# EasyEDA schematic SCH_Arduino-Nano_2025-06-12.json
TITLE: Arduino Nano; REV: 1.0; Date: 2025-06-07; Sheet: 1/1; Company: Jakub Witkowski
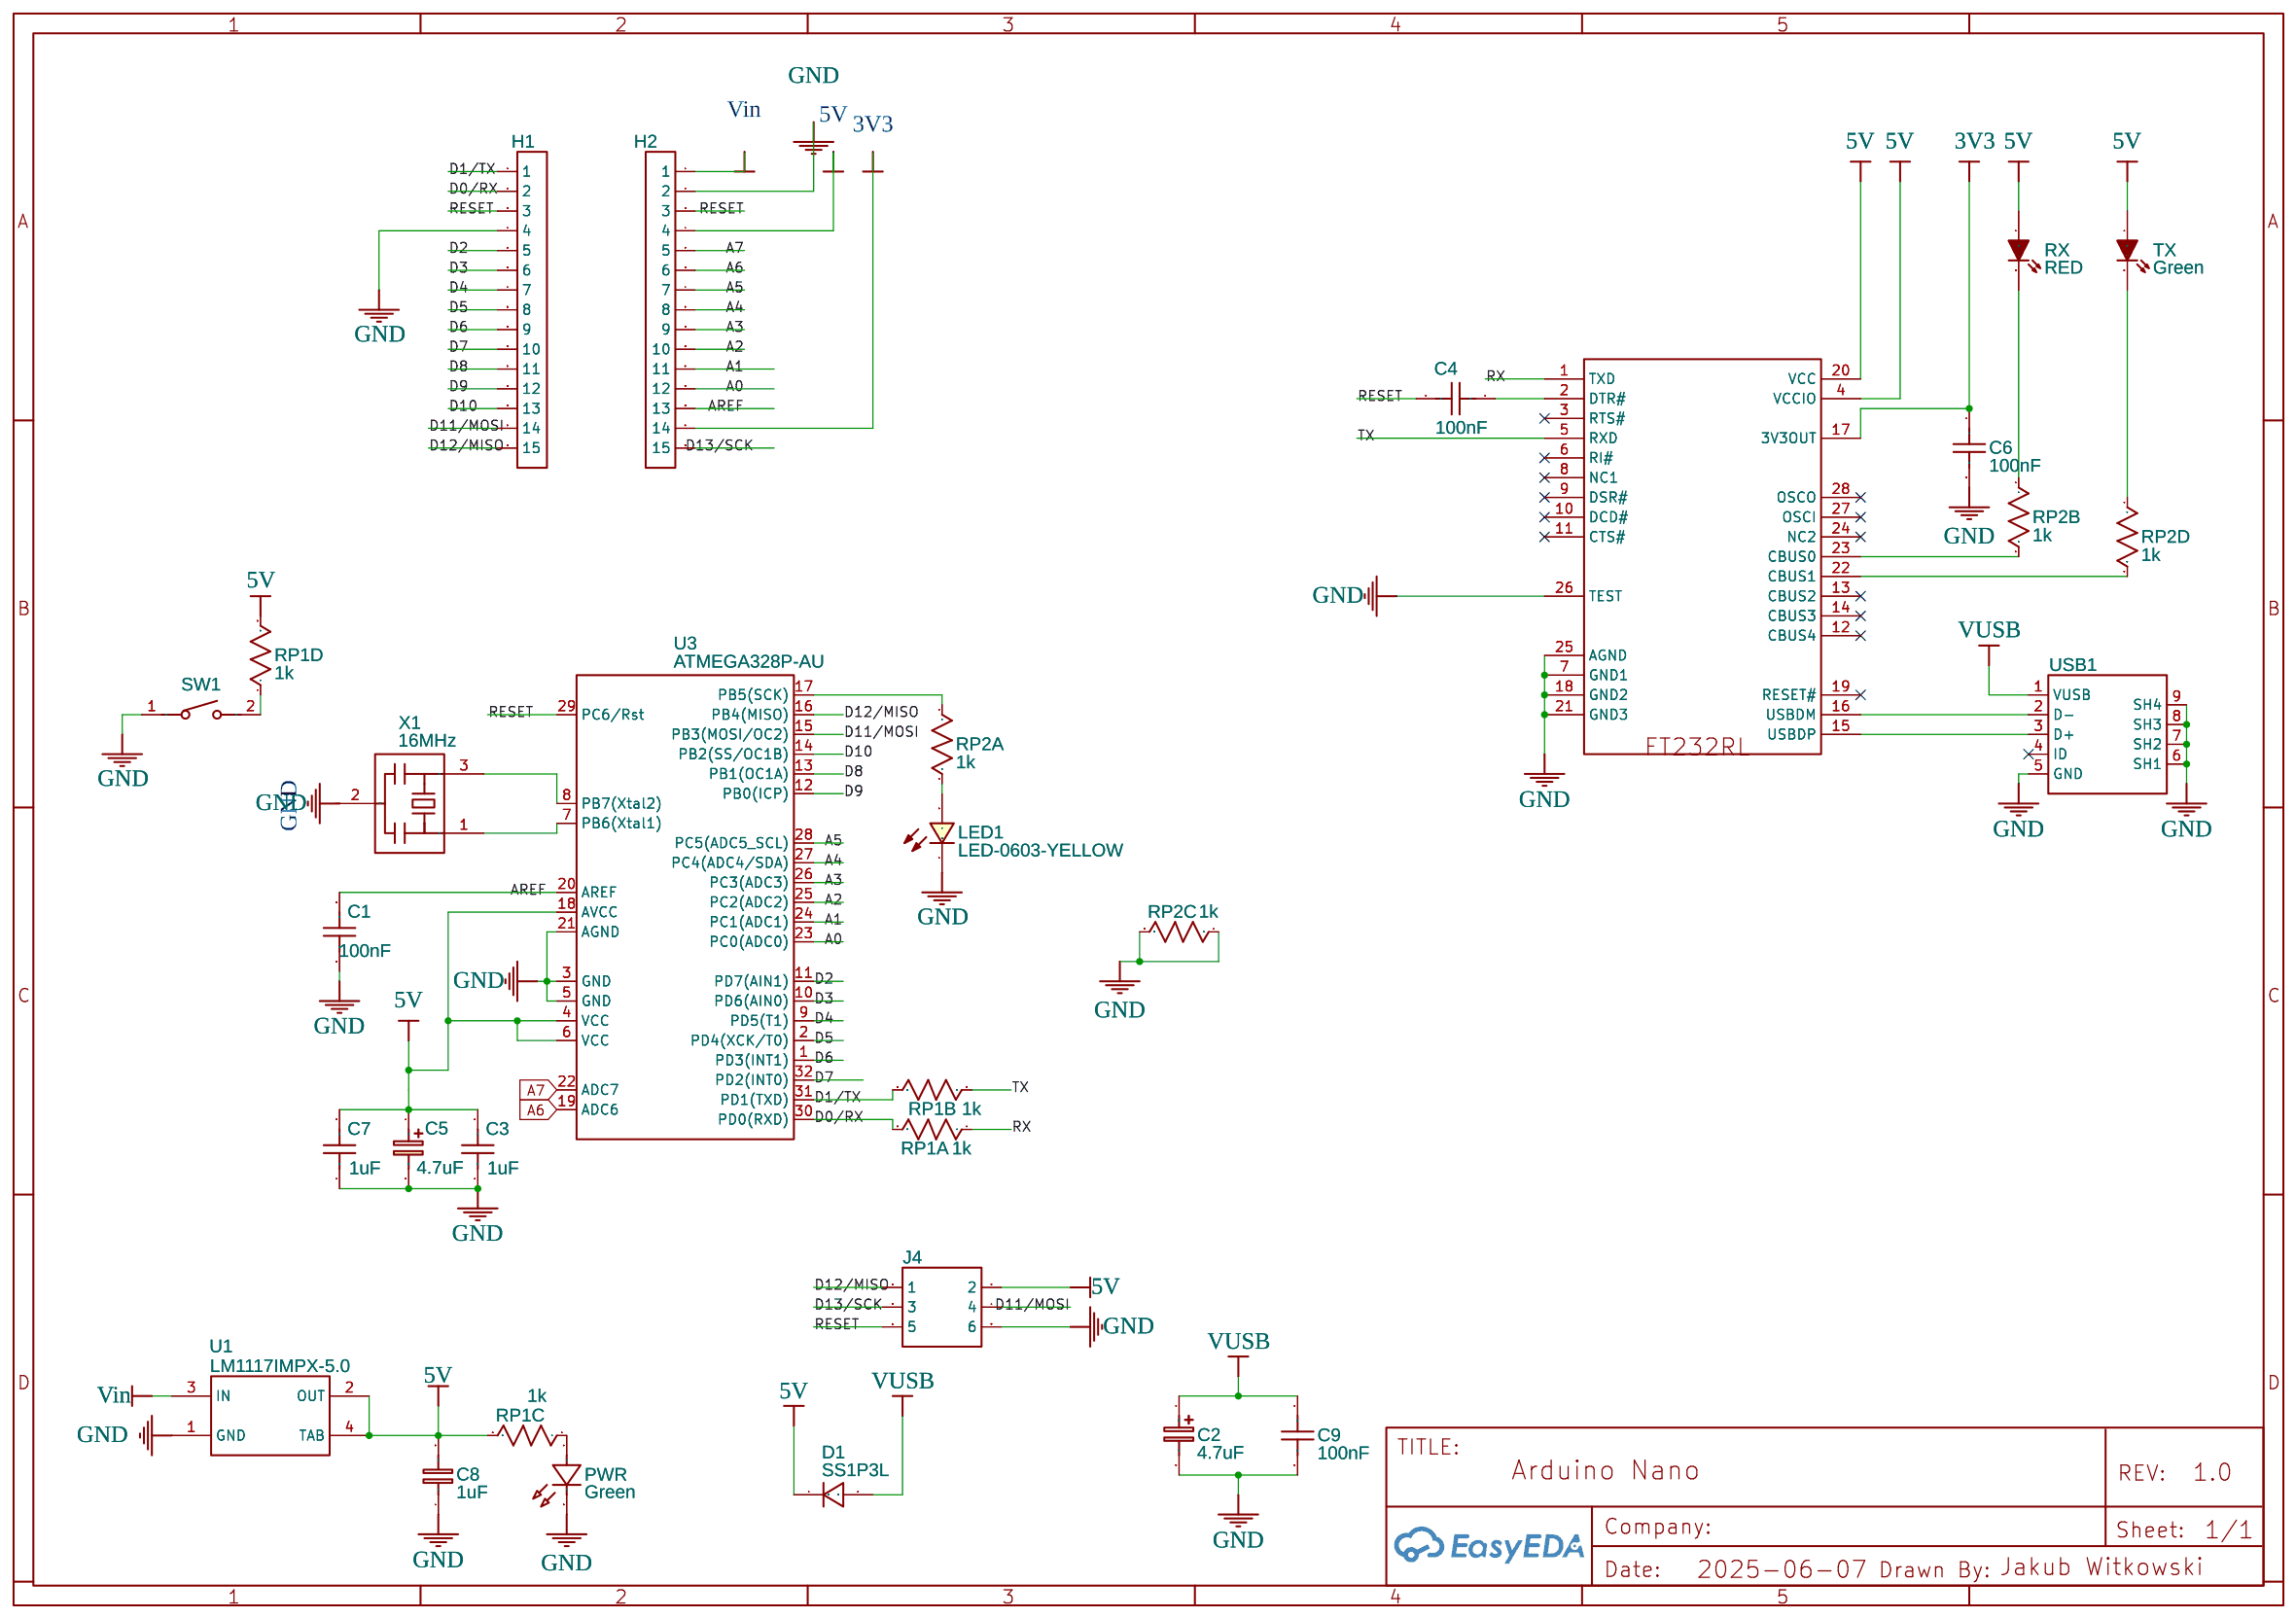
[diagram p0: schematic sheet]

## Parts
C1  100nF  [C0603]
C2  4.7uF  [CASE-A_3216]
C3  1uF  [C0603]
C4  100nF  [C0603]
C5  4.7uF  [CASE-A_3216]
C6  100nF  [C0603]
C7  1uF  [C0603]
C8  1uF  [C0603]
C9  100nF  [C0603]
D1  SS1P3L  [SOD-123FL_L2.6-W1.6-LS3.4-RD]
H1  Header-Female-2.54_1x15  [HDR-TH_15P-P2.54-V-F]
H2  Header-Female-2.54_1x15  [HDR-TH_15P-P2.54-V-F]
J4  HDR-M-2.54_2x3  [HDR-M-2.54_2X3]
LED1  LED-0603-YELLOW  [LED0603-RD-YELLOW]
PWR  Green  [LED-SMD_L3.8-W1.0-FD-GREEN-SIDE]
RP1A  1k  [R0603]
RP1B  1k  [R0603]
RP1C  1k  [R0603]
RP1D  1k  [R0603]
RP2A  1k  [R0603]
RP2B  1k  [R0603]
RP2C  1k  [R0603]
RP2D  1k  [R0603]
RX  RED  [LED-0603-RED]
SW1  TS-1088-AR02016  [SW-SMD_L4.0-W2.9-LS5.0]
TX  Green  [LED-0603-GREEN]
U1  LM1117IMPX-5.0  [SOT-223_L6.5-W3.5-P2.30-LS7.0-BR]
U2  FT232RL  [SSOP-28]
U3  ATMEGA328P-AU  [TQFP-32_L7.0-W7.0-P0.50-BL]
USB1  USB_MINI  [MINI-USB-SMD_KH-MINI-SMT-5P-CU]
X1  16MHz  [OSC-SMD_3P-L3.2-W1.3-P1.2-L]

## Library data of the parts
C1 C3 C4 C6 C7 C9 = C_0603_US: Contributor: LCEDA_Lib
C2 C5 = C_Tan_SMD_A_EU: Contributor: LCEDA_Lib
C8 = C_0603_EU: Contributor: LCEDA_Lib
D1 = 1N4148W: Supplier: LCSC; Manufacturer: Tak Cheong; Contributor: Tracy Concialdi; Supplier Part: C129216
H1 H2 = Header-Female-2.54_1x15: Supplier: LCSC; Manufacturer: Ckmtw; Manufacturer Part: 220S-1*15P H=8.5MM Ytype Gold-plated; Supplier Part: C124408; JLCPCB Part Class: Extended Part; Contributor: Alex_Tien
J4 = HDR-M-2.54_2x3: Supplier Part: C65114; Supplier: LCSC; Contributor: LCEDA_Lib
LED1 = LED-0603-YELLOW: Supplier: LCSC; Supplier Part: C264455; Manufacturer: Everlight Elec; Manufacturer Part: 19-213/Y2C-CQ1R1L/3T; Contributor: Esvoboda; JLCPCB Part Class: Extended Part
PWR = GREENLED_C9900016840: Contributor: lcsc; Supplier: LCSC; Supplier Part: C9900016840; Manufacturer: null; Manufacturer Part: GreenLED; JLCPCB Part Class: Extended Part
RP1A RP1B RP1C RP1D RP2A RP2B RP2C RP2D = R_0603_US: Contributor: LCEDA_Lib
RX = LED-0603-RED: Manufacturer: Hubei KENTO Elec; Manufacturer Part: KT-0603R; Supplier: LCSC; Supplier Part: C2286; link: https://datasheet.lcsc.com/lcsc/1810231112_Hubei-KENTO-Elec-KT-0603R_C2286.pdf; Contributor: abbos athamov
SW1 = TS-1088-AR02016: Supplier: LCSC; Supplier Part: C720477; Manufacturer: XUNPU; Contributor: LCSC; JLCPCB Part Class: Extended Part
TX = LED-0603-GREEN: Manufacturer: Yongyu Photoelectric; Manufacturer Part: SZYY0603YG; Supplier: LCSC; Supplier Part: C434423; link: https://datasheet.lcsc.com/lcsc/1912111437_Yongyu-Photoelectric-SZYY0603YG_C434423.pdf; Contributor: abbos.athamov.98
U1 = LM1117IMPX-5.0: Contributor: lcsc; Supplier: LCSC; Supplier Part: C3750936; Manufacturer: TI(德州仪器); JLCPCB Part Class: Extended Part
U2 = -: Contributor: Luo; sourceId: rLzLkiECY; Manufacturer Part: ?; Supplier: LCSC; Supplier Part: C8690
U3 = ATMEGA328P-AU: Manufacturer: Microchip Technology / Atmel; Supplier: Mouser; Supplier Part: 556-ATMEGA328P-AU; link: https://www.mouser.tw/ProductDetail/Microchip-Technology-Atmel/ATMEGA328P-AU?qs=sGAEpiMZZMtVoztFdqDXO3RbBx7FKCmV; Contributor: Alex_Tien
USB1 = USB_MINI: Contributor: Alex_Tien
X1 = CSTCE16M0V53C-R0: Supplier: Digi-Key; Manufacturer: MuRata; Manufacturer Part: CSTCE16M0V53-R0; Supplier Part: 490-1198-1-ND; link: https://www.digikey.de/product-detail/en/CSTCE16M0V53-R0/490-1198-1-ND/584635; Contributor: fahadssuet1995

## Nets
3V3: C6.1 H2.14 U2.17(3V3OUT)
5V: C3.2 C5.1 C7.2 C8.2 D1.1 H2.4 J4.2 RP1C.2 RP1D.2 RX.1 TX.1 U1.2(OUT) U1.4(TAB) U2.4(VCCIO) U2.20(VCC) U3.4(VCC) U3.6(VCC) U3.18(AVCC)
GND: C1.1 C2.2 C3.1 C5.2 C6.2 C7.1 C8.1 C9.2 H1.4 H2.2 J4.6 LED1.1(C) PWR.2(A) RP2C.1 RP2C.2 SW1.1 U1.1(GND) U2.7(GND1) U2.18(GND2) U2.21(GND3) U2.25(AGND) U2.26(TEST) U3.3(GND) U3.5(GND) U3.21(AGND) USB1.5(GND) USB1.6(SH1) USB1.7(SH2) USB1.8(SH3) USB1.9(SH4) X1.2
Vin: H2.1 U1.3(IN)
A0: H2.12 U3.23(PC0(ADC0))
A1: H2.11 U3.24(PC1(ADC1))
A2: H2.10 U3.25(PC2(ADC2))
A3: H2.9 U3.26(PC3(ADC3))
A4: H2.8 U3.27(PC4(ADC4/SDA))
A5: H2.7 U3.28(PC5(ADC5 SCL))
A6: H2.6 U3.19(ADC6)
A7: H2.5 U3.22(ADC7)
AREF: C1.2 H2.13 U3.20(AREF)
D0/RX: H1.2 RP1A.2 U3.30(PD0(RXD))
D1/TX: H1.1 RP1B.2 U3.31(PD1(TXD))
D2: H1.5 U3.11(PD7(AIN1))
D3: H1.6 U3.10(PD6(AIN0))
D4: H1.7 U3.9(PD5(T1))
D5: H1.8 U3.2(PD4(XCK/T0))
D6: H1.9 U3.1(PD3(INT1))
D7: H1.10 U3.32(PD2(INT0))
D8: H1.11 U3.13(PB1(OC1A))
D9: H1.12 U3.12(PB0(ICP))
D10: H1.13 U3.14(PB2(SS/OC1B))
D11/MOSI: H1.14 J4.4 U3.15(PB3(MOSI/OC2))
D12/MISO: H1.15 J4.1 U3.16(PB4(MISO))
D13/SCK: H2.15 J4.3
RESET: C4.2 H1.3 H2.3 J4.5 U3.29(PC6/Rst)
RX: RP1A.1 U2.1(TXD)
TX: RP1B.1 U2.5(RXD)
VUSB: C2.1 C9.1 D1.2 USB1.1(VUSB)
Net-(C4-1): C4.1 U2.2(DTR#)
Net-(LED1-2): LED1.2(A) RP2A.2
Net-(PWR-1): PWR.1(K) RP1C.1
Net-(RP1D-1): RP1D.1 SW1.2
Net-(RP2A-1): RP2A.1 U3.17(PB5(SCK))
Net-(RP2B-1): RP2B.1 RX.2
Net-(RP2B-2): RP2B.2 U2.23(CBUS0)
Net-(RP2D-1): RP2D.1 TX.2
Net-(RP2D-2): RP2D.2 U2.22(CBUS1)
Net-(U2-15): U2.15(USBDP) USB1.3(D+)
Net-(U2-16): U2.16(USBDM) USB1.2(D-)
Net-(U3-7): U3.7(PB6(Xtal1)) X1.1
Net-(U3-8): U3.8(PB7(Xtal2)) X1.3

Not connected (* = marked no-connect by the designer): U2 3(RTS#)* 6(RI#)* 8(NC1)* 9(DSR#)* 10(DCD#)* 11(CTS#)* 12(CBUS4)* 13(CBUS2)* 14(CBUS3)* 19(RESET#)* 24(NC2)* 27(OSCI)* 28(OSCO)*; USB1 4(ID)*

## Notes on the sheet
- GND
